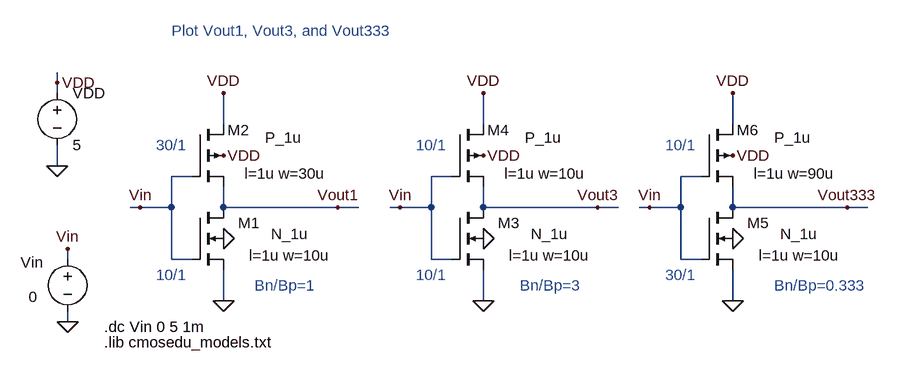
[diagram p0: schematic Fig11_8.asc]
Fig11_8.asc, the LTspice schematic file:
Version 4
SHEET 1 1476 680
WIRE 192 -368 192 -384
WIRE 192 -352 192 -368
WIRE 192 -240 192 -272
WIRE 208 -96 208 -112
WIRE 208 0 208 -16
WIRE 320 -176 304 -176
WIRE 368 -176 320 -176
WIRE 368 -176 368 -224
WIRE 368 -96 368 -176
WIRE 400 -224 368 -224
WIRE 400 -96 368 -96
WIRE 448 -304 448 -352
WIRE 448 -176 448 -208
WIRE 448 -32 448 -80
WIRE 624 -176 448 -176
WIRE 656 -176 624 -176
WIRE 720 -176 704 -176
WIRE 768 -176 720 -176
WIRE 768 -176 768 -224
WIRE 768 -96 768 -176
WIRE 800 -224 768 -224
WIRE 800 -96 768 -96
WIRE 848 -304 848 -352
WIRE 848 -176 848 -208
WIRE 848 -32 848 -80
WIRE 1024 -176 848 -176
WIRE 1056 -176 1024 -176
WIRE 1104 -176 1088 -176
WIRE 1152 -176 1104 -176
WIRE 1152 -176 1152 -224
WIRE 1152 -96 1152 -176
WIRE 1184 -224 1152 -224
WIRE 1184 -96 1152 -96
WIRE 1232 -304 1232 -352
WIRE 1232 -176 1232 -208
WIRE 1232 -32 1232 -80
WIRE 1408 -176 1232 -176
WIRE 1440 -176 1408 -176
FLAG 208 0 0
FLAG 624 -176 Vout1
FLAG 208 -112 Vin
FLAG 448 -128 0
FLAG 192 -240 0
FLAG 192 -368 VDD
FLAG 448 -256 VDD
FLAG 448 -32 0
FLAG 448 -352 VDD
FLAG 320 -176 Vin
FLAG 1024 -176 Vout3
FLAG 848 -128 0
FLAG 848 -256 VDD
FLAG 848 -32 0
FLAG 848 -352 VDD
FLAG 720 -176 Vin
FLAG 1408 -176 Vout333
FLAG 1232 -128 0
FLAG 1232 -256 VDD
FLAG 1232 -32 0
FLAG 1232 -352 VDD
FLAG 1104 -176 Vin
SYMBOL nmos4 400 -176 R0
WINDOW 0 104 24 Right 0
WINDOW 3 179 41 Right 0
WINDOW 123 213 74 Right 0
SYMATTR InstName M1
SYMATTR Value N_1u
SYMATTR Value2 l=1u w=10u
SYMBOL voltage 208 -112 R0
WINDOW 0 -72 21 Left 0
WINDOW 3 -60 74 Left 0
WINDOW 123 0 0 Left 0
WINDOW 39 0 0 Left 0
SYMATTR InstName Vin
SYMATTR Value 0
SYMBOL voltage 192 -368 R0
WINDOW 123 0 0 Left 0
WINDOW 39 0 0 Left 0
SYMATTR InstName VDD
SYMATTR Value 5
SYMBOL pmos4 400 -304 R0
WINDOW 0 88 9 Right 0
WINDOW 3 168 20 Right 0
WINDOW 123 206 76 Right 0
SYMATTR InstName M2
SYMATTR Value P_1u
SYMATTR Value2 l=1u w=30u
SYMBOL nmos4 800 -176 R0
WINDOW 0 104 24 Right 0
WINDOW 3 179 41 Right 0
WINDOW 123 213 74 Right 0
SYMATTR InstName M3
SYMATTR Value N_1u
SYMATTR Value2 l=1u w=10u
SYMBOL pmos4 800 -304 R0
WINDOW 0 88 9 Right 0
WINDOW 3 168 20 Right 0
WINDOW 123 206 76 Right 0
SYMATTR InstName M4
SYMATTR Value P_1u
SYMATTR Value2 l=1u w=10u
SYMBOL nmos4 1184 -176 R0
WINDOW 0 104 24 Right 0
WINDOW 3 179 41 Right 0
WINDOW 123 213 74 Right 0
SYMATTR InstName M5
SYMATTR Value N_1u
SYMATTR Value2 l=1u w=10u
SYMBOL pmos4 1184 -304 R0
WINDOW 0 88 9 Right 0
WINDOW 3 168 20 Right 0
WINDOW 123 206 76 Right 0
SYMATTR InstName M6
SYMATTR Value P_1u
SYMATTR Value2 l=1u w=90u
TEXT 264 8 Left 0 !.dc Vin 0 5 1m
TEXT 264 32 Left 0 !.lib cmosedu_models.txt
TEXT 368 -448 Left 0 ;Plot Vout1, Vout3, and Vout333
TEXT 344 -272 Left 0 ;30/1
TEXT 344 -72 Left 0 ;10/1
TEXT 744 -272 Left 0 ;10/1
TEXT 744 -72 Left 0 ;10/1
TEXT 1128 -272 Left 0 ;10/1
TEXT 1128 -72 Left 0 ;30/1
TEXT 496 -56 Left 0 ;Bn/Bp=1
TEXT 904 -56 Left 0 ;Bn/Bp=3
TEXT 1296 -56 Left 0 ;Bn/Bp=0.333

The netlist it stands for:
* Fig11_8.asc
M1 Vout1 Vin 0 0 N_1u l=1u w=10u
Vin Vin 0 0
VDD VDD 0 5
M2 VDD Vin Vout1 VDD P_1u l=1u w=30u
M3 Vout3 Vin 0 0 N_1u l=1u w=10u
M4 VDD Vin Vout3 VDD P_1u l=1u w=10u
M5 Vout333 Vin 0 0 N_1u l=1u w=10u
M6 VDD Vin Vout333 VDD P_1u l=1u w=90u
.model NMOS NMOS
.model PMOS PMOS
.lib standard.mos
.dc Vin 0 5 1m
.lib cmosedu_models.txt
* Plot Vout1, Vout3, and Vout333
* 30/1
* 10/1
* 10/1
* 10/1
* 10/1
* 30/1
* Bn/Bp=1
* Bn/Bp=3
* Bn/Bp=0.333
.backanno
.end